# EAGLE schematic wifiboard-v2 (EAGLE 8.2.1)
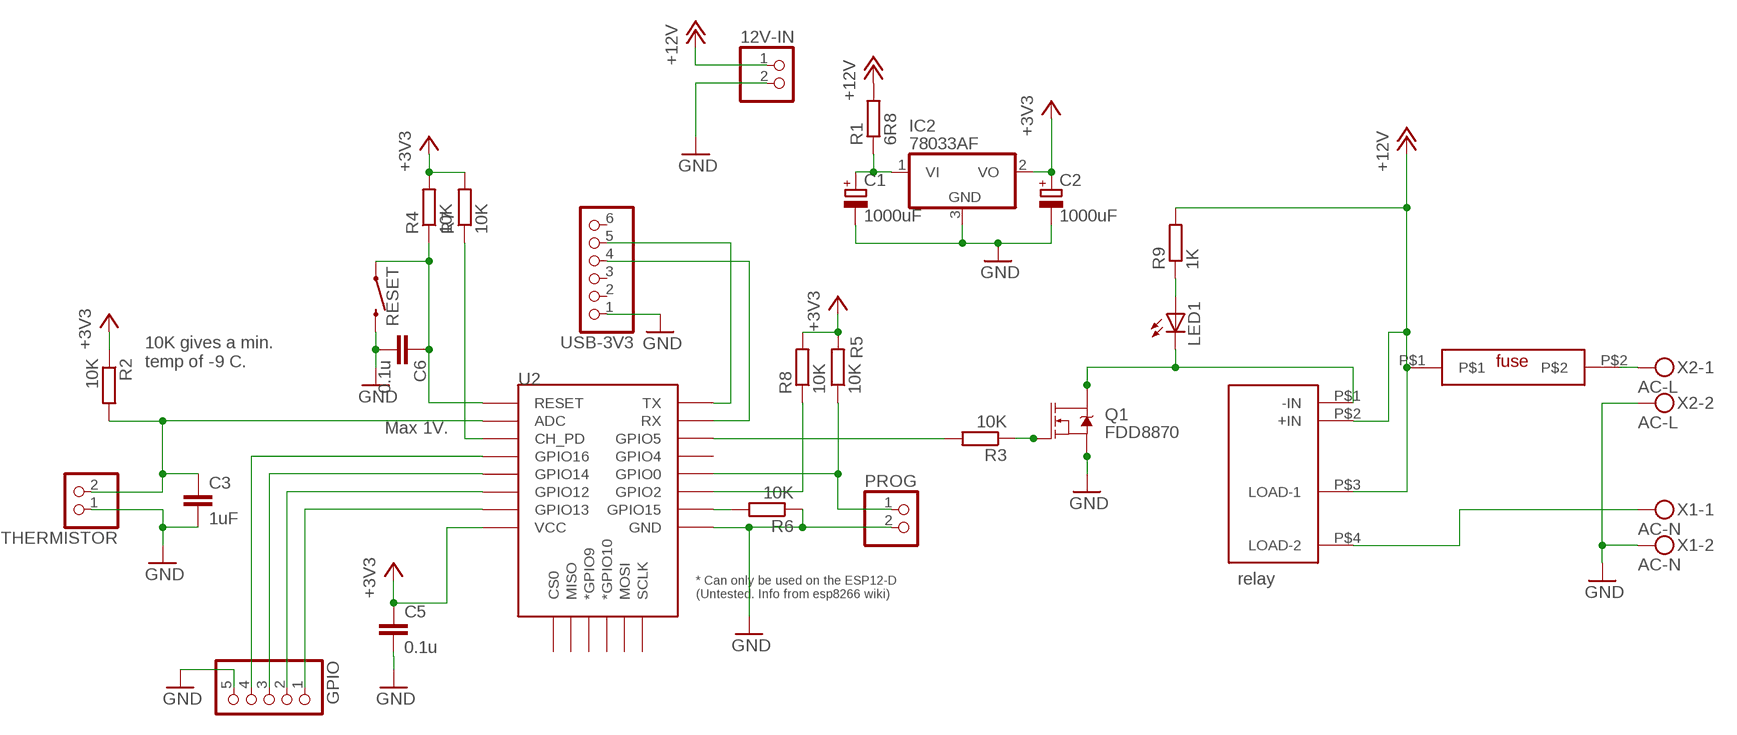
[diagram p0: schematic, sheet 1]

## Parts
12V-IN  PINHD-1X2  [1X02]
C1  1000uF  CPOL-EUB45181B  [B45181B]
C2  1000uF  CPOL-EUB45181B  [B45181B]
C3  1uF  C-EUC0805  [C0805]
C5  0.1u  C-EUC0805  [C0805]
C6  0.1u  C-EUC0805  [C0805]
FUSE  FUSE  [FUSE]
GPIO  PINHD-1X5  [1X05]
IC2  78033AF  7805DT  [TO252]
LED1  LED3MM  [LED3MM]
PROG  PINHD-1X2  [1X02]
Q1  FDD8870  MOSFET-NCH-FDD8780  [DPAK]
R1  6R8  R-EU_0207/10  [0207/10]
R2  10K  R-EU_M0805  [M0805]
R3  10K  R-EU_M0805  [M0805]
R4  10K  R-EU_R0805  [R0805]
R5  10K  R-EU_R0805  [R0805]
R6  10K  R-EU_R0805  [R0805]
R7  10K  R-EU_R0805  [R0805]
R8  10K  R-EU_R0805  [R0805]
R9  1K  R-EU_R0805  [R0805]
RELAY  OMRON-G6DS  [OMRON-G6DS-1A-H]
RESET  MOMENTARY-SWITCH-SPST-SMD-4.6X2.8MM  [TACTILE_SWITCH_SMD_4.6X2.8MM]
THERMISTOR  PINHD-1X2  [1X02]
U2  ESP12ESMD  [ESP12E-SMD]
USB-3V3  PINHD-1X6  [1X06]
X1  AC-N  MKDSN1,5/2-5,08  [MKDSN1,5/2-5,08]
X2  AC-L  MKDSN1,5/2-5,08  [MKDSN1,5/2-5,08]

## Nets
0: PROG.1 R5.1 U2.GPIO0
2: R8.1 U2.GPIO2
5: R3.2 U2.GPIO5
12: GPIO.2 U2.GPIO12
13: GPIO.1 U2.GPIO13
14: GPIO.3 U2.GPIO14
15: R6.2 U2.GPIO15
16: GPIO.4 U2.GPIO16
+3V3: C2.+ C5.1 IC2.2(VO) R2.1 R4.2 R5.2 R7.2 R8.2 U2.VCC
+12V: 12V-IN.1 FUSE.P$1 R1.2 R9.2 RELAY.P$2(+IN) RELAY.P$3(LOAD-1)
A0: C3.1 R2.2 THERMISTOR.2 U2.ADC
CH_PD: R7.1 U2.CH_PD
GND: 12V-IN.2 C1.- C2.- C3.2 C5.2 C6.2 GPIO.5 IC2.3(GND) PROG.2 Q1.3(S) R6.1 RESET.3 RESET.4 THERMISTOR.1 U2.GND USB-3V3.1 X1.2 X2.2
N$2: C1.+ IC2.1(VI) R1.1
N$5: Q1.1(G) R3.1
N$7: LED1.K(C) Q1.4(D) RELAY.P$1(-IN)
N$10: RELAY.P$4(LOAD-2) X1.1
N$12: FUSE.P$2 X2.1
N$14: LED1.A R9.1
RST: C6.1 R4.1 RESET.1 RESET.2 U2.RESET
RX: U2.RXD0(RX) USB-3V3.4
TX: U2.TXD0(TX) USB-3V3.5
Unconnected: U2.CS0 U2.GPIO4 U2.GPIO9(*GPIO9) U2.GPIO10(*GPIO10) U2.MISO U2.MOSI U2.SCLK USB-3V3.2 USB-3V3.3 USB-3V3.6

## Notes on the sheet
- 10K gives a min. 
  temp of -9 C.
- Max 1V.
- relay

## Library data of the parts
12V-IN PROG THERMISTOR = pinhead:PINHD-1X2: PIN HEADER
C1 C2 = rcl:CPOL-EU: POLARIZED CAPACITOR, European symbol
C3 C5 C6 = rcl:C-EU: CAPACITOR, European symbol
FUSE = alexa:FUSE
GPIO = pinhead:PINHD-1X5: PIN HEADER
IC2 = adafruit:78*: Positive VOLTAGE REGULATOR Added bigger pads to the TO-92 package
LED1 = led:LED: LED OSRAM: - CHIPLED LG R971, LG N971, LY N971, LG Q971, LY Q971, LO R971, LY R971 LH N974, LH R974 LS Q976, LO Q976, LY Q976 LO Q996 - Hyper CHIPLED LW Q18S LB Q993, LB Q99A, LB R99A - SideLED LS A670, LO A670, LY A670, LG A670, LP A670 LB A673, LV A673, LT A673, LW A673 LH A674 LY A675 LS A676, LA A676, LO A676, LY A676, LW A676 LS A679, LY A679, LG A679 - Hyper Micro SIDELED® LS Y876, LA Y876, LO Y876, LY Y876 LT Y87S - SmartLED LW L88C, LW L88S LB L89C, LB L89S, LG L890 LS L89K, LO L89K, LY L89K LS L896, LA L896, LO L896, LY L896 - TOPLED LS T670, LO T670, LY T670, LG T670, LP T670 LSG T670, LSP T670, LSY T670, LOP T670, LYG T670 LG T671, LOG T671, LSG T671 LB T673, LV T673, LT T673, LW T673 LH T674 LS T676, LA T676, LO T676, LY T676, LB T676, LH T676, LSB T676, LW T676 LB T67C, LV T67C, LT T67C, LS T67K, LO T67K, LY T67K, LW E67C LS E67B, LA E67B, LO E67B, LY E67B, LB E67C, LV E67C, LT E67C LW T67C LS T679, LY T679, LG T679 LS T770, LO T770, LY T770, LG T770, LP T770 LB T773, LV T773, LT T773, LW T773 LH T774 LS E675, LA E675, LY E675, LS T675 LS T776, LA T776, LO T776, LY T776, LB T776 LHGB T686 LT T68C, LB T68C - Hyper Mini TOPLED® LB M676 - Mini TOPLED Santana® LG M470 LS M47K, LO M47K, LY M47K Source: http://www.osram.convergy.de LUXEON: - LUMILED® LXK2-PW12-R00, LXK2-PW12-S00, LXK2-PW14-U00, LXK2-PW14-V00 LXK2-PM12-R00, LXK2-PM12-S00, LXK2-PM14-U00 LXK2-PE12-Q00, LXK2-PE12-R00, LXK2-PE12-S00, LXK2-PE14-T00, LXK2-PE14-U00 LXK2-PB12-K00, LXK2-PB12-L00, LXK2-PB12-M00, LXK2-PB14-N00, LXK2-PB14-P00, LXK2-PB14-Q00 LXK2-PR12-L00, LXK2-PR12-M00, LXK2-PR14-Q00, LXK2-PR14-R00 LXK2-PD12-Q00, LXK2-PD12-R00, LXK2-PD12-S00 LXK2-PH12-R00, LXK2-PH12-S00 LXK2-PL12-P00, LXK2-PL12-Q00, LXK2-PL12-R00 Source: www.luxeon.com KINGBRIGHT: KA-3528ASYC Source: www.kingbright.com
Q1 = SparkFun-DiscreteSemi:MOSFET-NCH: N-channel MOSFETs Voltage controlled devices that allow control of high current outputs. SparkFun Products: SparkFun OpenScale <https://www.sparkfun.com/products/13261> SparkFun Digital Sandbox <https://www.sparkfun.com/products/12651> SparkFun Monster Moto Shield <https://www.sparkfun.com/products/10182> SparkFun MOSFET Power Controller <https://www.sparkfun.com/products/11214>; PROD_ID: TRANS-09984; VALUE: 35A/25V/8.5mΩ
R1-R9 = rcl:R-EU_: RESISTOR, European symbol
RELAY = alexa:OMRON-G6DS
RESET = SparkFun-Switches:MOMENTARY-SWITCH-SPST: Momentary Switch (Pushbutton) - SPST Normally-open (NO) SPST momentary switches (buttons, pushbuttons). Variants PTH-12MM - 12mm square, through-hole Momentary Pushbutton Switch - 12mm Square <https://www.sparkfun.com/products/9190> (COM-09190) PTH-6.0MM, PTH-6.0MM-KIT - 6.0mm square, through-hole Mini Pushbutton Switch <https://www.sparkfun.com/products/97> (COM-00097) KIT package intended for soldering kit's - only one side of pads' copper is exposed. PTH-RIGHT-ANGLE-KIT - Right-angle, through-hole Right Angle Tactile Button <https://www.sparkfun.com/products/10791> - Used on SparkFun BigTime Watch Kit <https://www.sparkfun.com/products/11734> SMD-12MM - 12mm square, surface-mount Tactile Button - SMD (12mm) <https://www.sparkfun.com/products/12993> (COM-12993) Used on SparkFun PicoBoard <https://www.sparkfun.com/products/11888> SMD-4.5MM - 4.5mm Square Trackball Switch Used on SparkFun Blackberry Trackballer Breakout <https://www.sparkfun.com/products/13169> SMD-4.6MMX2.8MM - 4.60mm x 2.80mm, surface mount Used on SparkFun SAMD21 Mini Breakout <https://www.sparkfun.com/products/13664> SMD-5.2MM, SMD-5.2-REDUNDANT - 5.2mm square, surface-mount Mini Pushbutton Switch - SMD <https://www.sparkfun.com/products/8720> (COM-08720) Used on Arduino Pro Mini <https://www.sparkfun.com/products/11114> REDUNDANT package connects both switch circuits together SMD-6.0X3.5MM - 6.0 x 3.5mm, surface mount Momentary Reset Switch SMD <https://www.sparkfun.com/products/8229> (COM-08229) SMD-6.2MM-TALL - 6.2mm square, surface mount Tactile Button - SMD (6mm) <https://www.sparkfun.com/products/12992> Used on SparkFun Digital Sandbox <https://www.sparkfun.com/products/12651> SMD-RIGHT-ANGLE - Right-angle, surface mount Used on SparkFun Block for Intel® Edison - Arduino <https://www.sparkfun.com/products/13036>; PROD_ID: SWCH-13065
U2 = esp8266modules:ESP12E: ESP12E Module
USB-3V3 = pinhead:PINHD-1X6: PIN HEADER
X1 X2 = con-phoenix-508:MKDSN1,5/2-5,08: MKDSN 1,5/ 2-5,08 Printklemme Nennstrom: 13,5 A Nennspannung: 250 V Rastermaß: 5,08 mm Polzahl: 2 Anschlussart: Schraubanschluss Montage: Löten Anschlussrichtung Leiter/Platine: 0 ° Artikelnummer: 1729128 Source: http://eshop.phoenixcontact.com .. 1729128.pdf